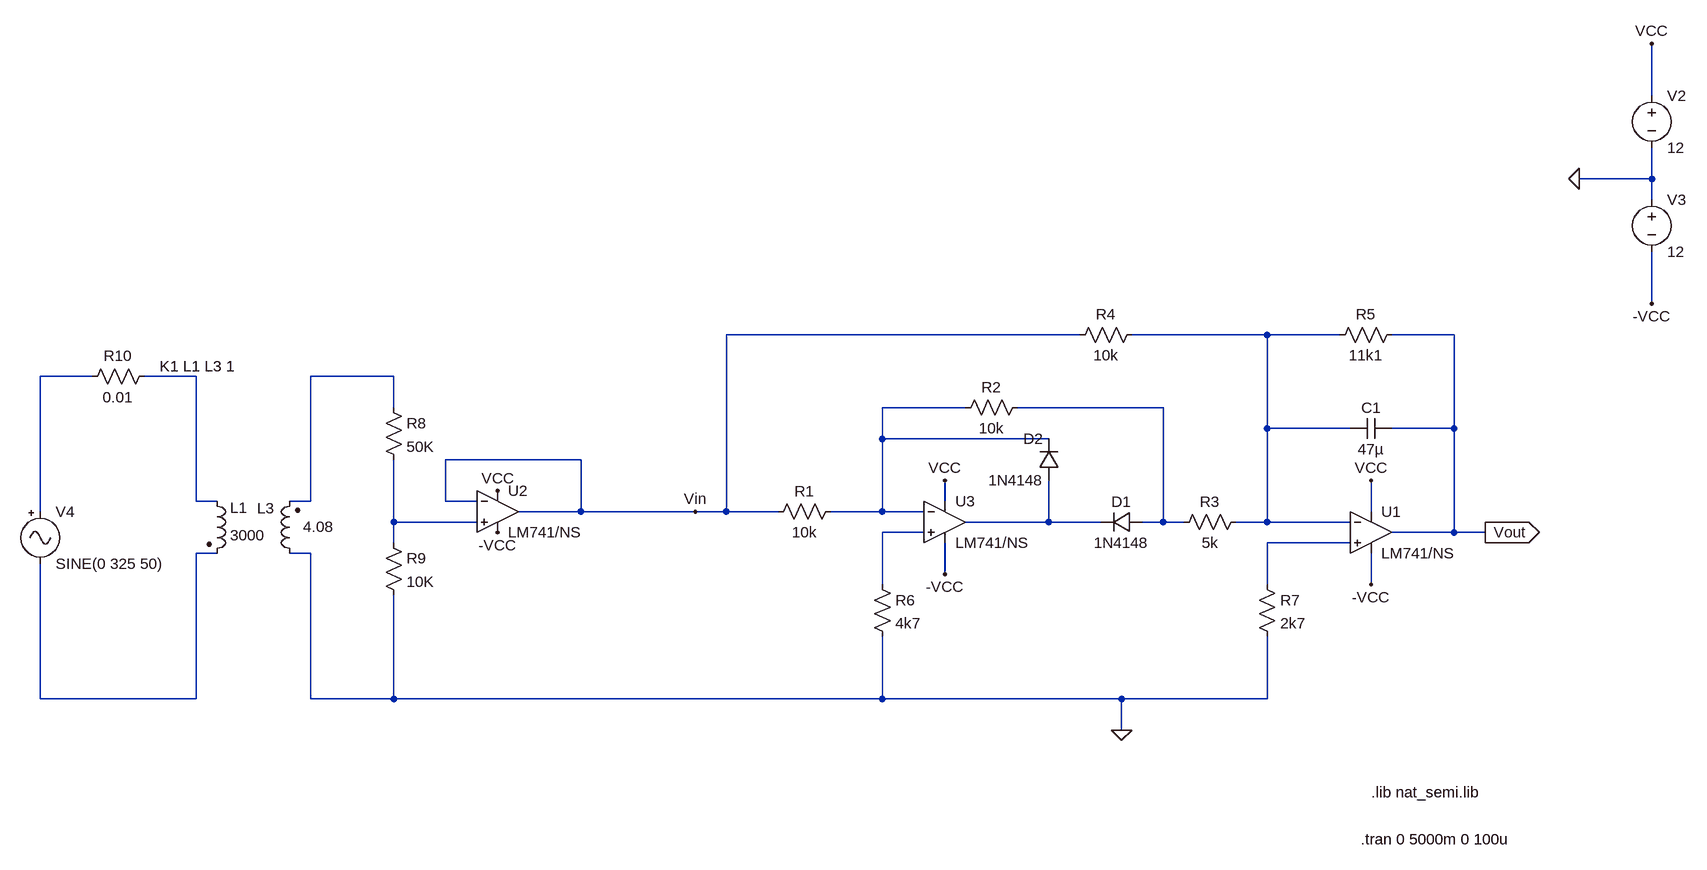
[diagram p0: schematic AC-linevoltage.asc]
AC-linevoltage.asc, the LTspice schematic file:
Version 4
SHEET 1 1468 680
WIRE 1344 -528 1344 -608
WIRE 1344 -400 1344 -448
WIRE 1344 -400 1232 -400
WIRE 1344 -368 1344 -400
WIRE 1344 -208 1344 -288
WIRE 464 -160 -80 -160
WIRE 752 -160 544 -160
WIRE 864 -160 752 -160
WIRE 1040 -160 944 -160
WIRE -1056 -96 -1136 -96
WIRE -896 -96 -976 -96
WIRE -592 -96 -720 -96
WIRE -592 -48 -592 -96
WIRE 288 -48 160 -48
WIRE 592 -48 368 -48
WIRE 752 -16 752 -160
WIRE 880 -16 752 -16
WIRE 1040 -16 1040 -160
WIRE 1040 -16 944 -16
WIRE 160 0 160 -48
WIRE 416 0 160 0
WIRE -304 32 -512 32
WIRE -896 96 -896 -96
WIRE -864 96 -896 96
WIRE -720 96 -720 -96
WIRE -720 96 -752 96
WIRE -512 96 -512 32
WIRE -464 96 -512 96
WIRE 256 96 256 64
WIRE -1136 112 -1136 -96
WIRE -304 112 -304 32
WIRE -304 112 -400 112
WIRE -128 112 -304 112
WIRE -80 112 -80 -160
WIRE -80 112 -128 112
WIRE 0 112 -80 112
WIRE 160 112 160 0
WIRE 160 112 80 112
WIRE 224 112 160 112
WIRE 912 112 912 64
WIRE -592 128 -592 32
WIRE -464 128 -592 128
WIRE 416 128 416 64
WIRE 416 128 288 128
WIRE 496 128 416 128
WIRE 592 128 592 -48
WIRE 592 128 560 128
WIRE 624 128 592 128
WIRE 752 128 752 -16
WIRE 752 128 704 128
WIRE 880 128 752 128
WIRE 224 144 160 144
WIRE 1040 144 1040 -16
WIRE 1040 144 944 144
WIRE 1088 144 1040 144
WIRE -592 160 -592 128
WIRE 880 160 752 160
WIRE -864 176 -896 176
WIRE -720 176 -752 176
WIRE 256 208 256 160
WIRE 160 224 160 144
WIRE 752 224 752 160
WIRE 912 224 912 176
WIRE -1136 400 -1136 192
WIRE -896 400 -896 176
WIRE -896 400 -1136 400
WIRE -720 400 -720 176
WIRE -592 400 -592 240
WIRE -592 400 -720 400
WIRE 160 400 160 304
WIRE 160 400 -592 400
WIRE 528 400 160 400
WIRE 752 400 752 304
WIRE 752 400 528 400
WIRE 528 448 528 400
FLAG 528 448 0
FLAG 256 64 VCC
FLAG 912 64 VCC
FLAG 256 208 -VCC
FLAG 912 224 -VCC
FLAG 1232 -400 0
FLAG 1344 -608 VCC
FLAG 1344 -208 -VCC
FLAG 1088 144 Vout
IOPIN 1088 144 Out
FLAG -432 80 VCC
FLAG -432 144 -VCC
FLAG -128 112 Vin
SYMBOL res 96 96 R90
WINDOW 0 0 56 VBottom 2
WINDOW 3 32 56 VTop 2
SYMATTR InstName R1
SYMATTR Value 10k
SYMBOL res 384 -64 R90
WINDOW 0 0 56 VBottom 2
WINDOW 3 32 56 VTop 2
SYMATTR InstName R2
SYMATTR Value 10k
SYMBOL res 560 -176 R90
WINDOW 0 0 56 VBottom 2
WINDOW 3 32 56 VTop 2
SYMATTR InstName R4
SYMATTR Value 10k
SYMBOL diode 560 112 R90
WINDOW 0 0 32 VBottom 2
WINDOW 3 32 32 VTop 2
SYMATTR InstName D1
SYMATTR Value 1N4148
SYMBOL res 720 112 R90
WINDOW 0 0 56 VBottom 2
WINDOW 3 32 56 VTop 2
SYMATTR InstName R3
SYMATTR Value 5k
SYMBOL diode 432 64 R180
WINDOW 0 24 64 Left 2
WINDOW 3 24 0 Left 2
SYMATTR InstName D2
SYMATTR Value 1N4148
SYMBOL res 960 -176 R90
WINDOW 0 0 56 VBottom 2
WINDOW 3 32 56 VTop 2
SYMATTR InstName R5
SYMATTR Value 11k1
SYMBOL cap 944 -32 R90
WINDOW 0 0 32 VBottom 2
WINDOW 3 32 32 VTop 2
SYMATTR InstName C1
SYMATTR Value 47µ
SYMBOL res 144 208 R0
SYMATTR InstName R6
SYMATTR Value 4k7
SYMBOL res 736 208 R0
SYMATTR InstName R7
SYMATTR Value 2k7
SYMBOL Opamps\\opamp2 256 64 R0
SYMATTR InstName U3
SYMATTR Value LM741/NS
SYMBOL Opamps\\opamp2 912 80 R0
SYMATTR InstName U1
SYMATTR Value LM741/NS
SYMBOL voltage 1344 -544 R0
SYMATTR InstName V2
SYMATTR Value 12
SYMBOL voltage 1344 -384 R0
SYMATTR InstName V3
SYMATTR Value 12
SYMBOL res -608 -64 R0
SYMATTR InstName R8
SYMATTR Value 50K
SYMBOL res -608 144 R0
SYMATTR InstName R9
SYMATTR Value 10K
SYMBOL OpAmps\\opamp2 -432 48 R0
SYMATTR InstName U2
SYMATTR Value LM741/NS
SYMBOL Misc\\signal -1136 96 R0
WINDOW 123 0 0 Left 0
WINDOW 39 0 0 Left 0
SYMATTR InstName V4
SYMATTR Value SINE(0 325 50)
SYMBOL ind2 -880 80 R0
WINDOW 0 36 26 Left 2
WINDOW 3 36 68 Left 2
SYMATTR InstName L1
SYMATTR Value 3000
SYMATTR Type ind
SYMBOL ind2 -736 192 R180
WINDOW 0 39 85 Left 2
WINDOW 3 -52 57 Left 2
SYMATTR InstName L3
SYMATTR Value 4.08
SYMATTR Type ind
SYMBOL res -960 -112 R90
WINDOW 0 0 56 VBottom 2
WINDOW 3 32 56 VTop 2
SYMATTR InstName R10
SYMATTR Value 0.01
TEXT 896 616 Left 2 !.tran 0 5000m 0 100u
TEXT 912 544 Left 2 !.lib nat_semi.lib
TEXT -952 -112 Left 2 !K1 L1 L3 1

The netlist it stands for:
* AC-linevoltage.asc
R1 N005 Vin 10k
R2 N006 N005 10k
R4 N001 Vin 10k
D1 N006 N008 1N4148
R3 N001 N006 5k
D2 N008 N005 1N4148
R5 Vout N001 11k1
C1 Vout N001 47µ
R6 N009 0 4k7
R7 N010 0 2k7
XU3 N009 N005 VCC -VCC N008 LM741/NS  ; pins In+ In- V+ V- OUT
XU1 N010 N001 VCC -VCC Vout LM741/NS  ; pins In+ In- V+ V- OUT
V2 VCC 0 12
V3 0 -VCC 12
R8 N004 N007 50K
R9 N007 0 10K
XU2 N007 Vin VCC -VCC Vin LM741/NS  ; pins In+ In- V+ V- OUT
V4 N002 N011 SINE(0 325 50)
L1 N003 N011 3000
L3 0 N004 4.08
R10 N003 N002 0.01
.model D D
.lib standard.dio
.tran 0 5000m 0 100u
.lib nat_semi.lib
K1 L1 L3 1
.backanno
.end